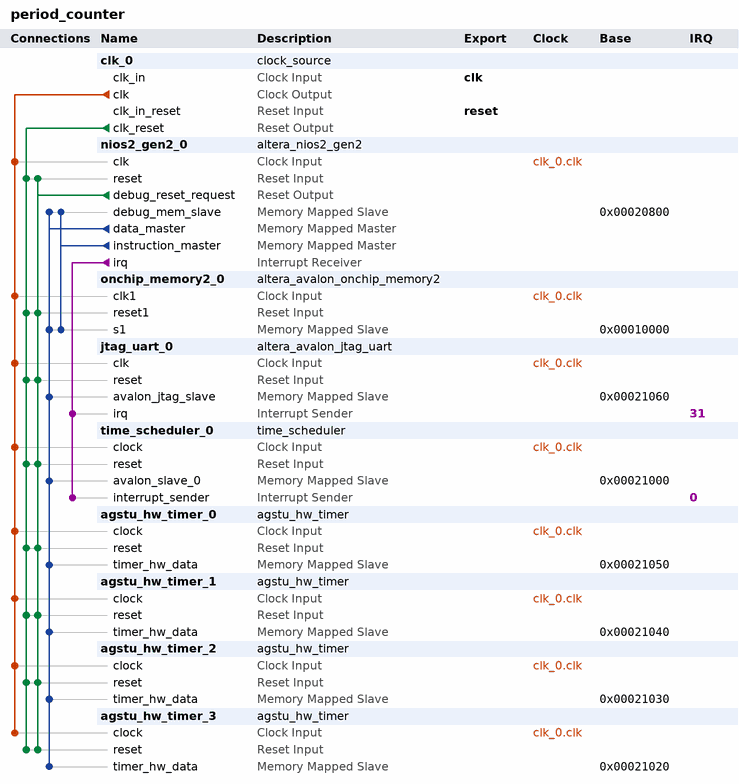
[diagram p0: system contents]
# Platform Designer (Qsys) system period_counter, MAX 10 10M50DAF484C7G
# Parameters at their usual value, and those the tool derives, are not listed.
package require -exact qsys 18.1
create_system period_counter
set_project_property DEVICE_FAMILY {MAX 10}
set_project_property DEVICE 10M50DAF484C7G

add_instance clk_0 clock_source 18.1
set_instance_parameter_value clk_0 clockFrequency 50000000

add_instance nios2_gen2_0 altera_nios2_gen2 18.1
set_instance_parameter_value nios2_gen2_0 dcache_size 2048
set_instance_parameter_value nios2_gen2_0 exceptionSlave onchip_memory2_0.s1
set_instance_parameter_value nios2_gen2_0 icache_size 4096
set_instance_parameter_value nios2_gen2_0 impl Tiny
set_instance_parameter_value nios2_gen2_0 resetSlave onchip_memory2_0.s1

add_instance onchip_memory2_0 altera_avalon_onchip_memory2 18.1
set_instance_parameter_value onchip_memory2_0 dataWidth 32
set_instance_parameter_value onchip_memory2_0 dualPort false
set_instance_parameter_value onchip_memory2_0 initMemContent false
set_instance_parameter_value onchip_memory2_0 initializationFileName onchip_mem.hex
set_instance_parameter_value onchip_memory2_0 memorySize 33796

add_instance jtag_uart_0 altera_avalon_jtag_uart 18.1
set_instance_parameter_value jtag_uart_0 simInteractiveOptions NO_INTERACTIVE_WINDOWS

add_instance time_scheduler_0 time_scheduler 1.0.1
set_instance_parameter_value time_scheduler_0 counter_height 3
set_instance_parameter_value time_scheduler_0 per0 2
set_instance_parameter_value time_scheduler_0 per1 7
set_instance_parameter_value time_scheduler_0 per10 11
set_instance_parameter_value time_scheduler_0 per11 12
set_instance_parameter_value time_scheduler_0 per12 13
set_instance_parameter_value time_scheduler_0 per13 14
set_instance_parameter_value time_scheduler_0 per14 15
set_instance_parameter_value time_scheduler_0 per15 16
set_instance_parameter_value time_scheduler_0 per2 15
set_instance_parameter_value time_scheduler_0 per3 4
set_instance_parameter_value time_scheduler_0 per4 5
set_instance_parameter_value time_scheduler_0 per5 6
set_instance_parameter_value time_scheduler_0 per6 7
set_instance_parameter_value time_scheduler_0 per7 8
set_instance_parameter_value time_scheduler_0 per8 9
set_instance_parameter_value time_scheduler_0 per9 10
set_instance_parameter_value time_scheduler_0 tick_length 25000000

add_instance agstu_hw_timer_0 agstu_hw_timer 0.0.2

add_instance agstu_hw_timer_1 agstu_hw_timer 0.0.2

add_instance agstu_hw_timer_2 agstu_hw_timer 0.0.2

add_instance agstu_hw_timer_3 agstu_hw_timer 0.0.2

# connections
add_connection clk_0.clk agstu_hw_timer_0.clock clock
add_connection clk_0.clk agstu_hw_timer_1.clock clock
add_connection clk_0.clk agstu_hw_timer_2.clock clock
add_connection clk_0.clk agstu_hw_timer_3.clock clock
add_connection clk_0.clk jtag_uart_0.clk clock
add_connection clk_0.clk nios2_gen2_0.clk clock
add_connection clk_0.clk onchip_memory2_0.clk1 clock
add_connection clk_0.clk time_scheduler_0.clock clock
add_connection clk_0.clk_reset agstu_hw_timer_0.reset reset
add_connection clk_0.clk_reset agstu_hw_timer_1.reset reset
add_connection clk_0.clk_reset agstu_hw_timer_2.reset reset
add_connection clk_0.clk_reset agstu_hw_timer_3.reset reset
add_connection clk_0.clk_reset jtag_uart_0.reset reset
add_connection clk_0.clk_reset nios2_gen2_0.reset reset
add_connection clk_0.clk_reset onchip_memory2_0.reset1 reset
add_connection clk_0.clk_reset time_scheduler_0.reset reset
add_connection nios2_gen2_0.debug_reset_request agstu_hw_timer_0.reset reset
add_connection nios2_gen2_0.debug_reset_request agstu_hw_timer_1.reset reset
add_connection nios2_gen2_0.debug_reset_request agstu_hw_timer_2.reset reset
add_connection nios2_gen2_0.debug_reset_request agstu_hw_timer_3.reset reset
add_connection nios2_gen2_0.debug_reset_request jtag_uart_0.reset reset
add_connection nios2_gen2_0.debug_reset_request nios2_gen2_0.reset reset
add_connection nios2_gen2_0.debug_reset_request onchip_memory2_0.reset1 reset
add_connection nios2_gen2_0.debug_reset_request time_scheduler_0.reset reset
add_connection nios2_gen2_0.data_master agstu_hw_timer_0.timer_hw_data avalon
set_connection_parameter_value nios2_gen2_0.data_master/agstu_hw_timer_0.timer_hw_data baseAddress 0x00021050
add_connection nios2_gen2_0.data_master agstu_hw_timer_1.timer_hw_data avalon
set_connection_parameter_value nios2_gen2_0.data_master/agstu_hw_timer_1.timer_hw_data baseAddress 0x00021040
add_connection nios2_gen2_0.data_master agstu_hw_timer_2.timer_hw_data avalon
set_connection_parameter_value nios2_gen2_0.data_master/agstu_hw_timer_2.timer_hw_data baseAddress 0x00021030
add_connection nios2_gen2_0.data_master agstu_hw_timer_3.timer_hw_data avalon
set_connection_parameter_value nios2_gen2_0.data_master/agstu_hw_timer_3.timer_hw_data baseAddress 0x00021020
add_connection nios2_gen2_0.data_master jtag_uart_0.avalon_jtag_slave avalon
set_connection_parameter_value nios2_gen2_0.data_master/jtag_uart_0.avalon_jtag_slave baseAddress 0x00021060
add_connection nios2_gen2_0.data_master nios2_gen2_0.debug_mem_slave avalon
set_connection_parameter_value nios2_gen2_0.data_master/nios2_gen2_0.debug_mem_slave baseAddress 0x00020800
add_connection nios2_gen2_0.data_master onchip_memory2_0.s1 avalon
set_connection_parameter_value nios2_gen2_0.data_master/onchip_memory2_0.s1 baseAddress 0x00010000
add_connection nios2_gen2_0.data_master time_scheduler_0.avalon_slave_0 avalon
set_connection_parameter_value nios2_gen2_0.data_master/time_scheduler_0.avalon_slave_0 baseAddress 0x00021000
add_connection nios2_gen2_0.instruction_master nios2_gen2_0.debug_mem_slave avalon
set_connection_parameter_value nios2_gen2_0.instruction_master/nios2_gen2_0.debug_mem_slave baseAddress 0x00020800
add_connection nios2_gen2_0.instruction_master onchip_memory2_0.s1 avalon
set_connection_parameter_value nios2_gen2_0.instruction_master/onchip_memory2_0.s1 baseAddress 0x00010000
add_connection nios2_gen2_0.irq jtag_uart_0.irq interrupt
set_connection_parameter_value nios2_gen2_0.irq/jtag_uart_0.irq irqNumber 31
add_connection nios2_gen2_0.irq time_scheduler_0.interrupt_sender interrupt
set_connection_parameter_value nios2_gen2_0.irq/time_scheduler_0.interrupt_sender irqNumber 0

# exported interfaces
add_interface clk clock sink
set_interface_property clk EXPORT_OF clk_0.clk_in
add_interface reset reset sink
set_interface_property reset EXPORT_OF clk_0.clk_in_reset

set_interconnect_requirement {$system} qsys_mm.clockCrossingAdapter HANDSHAKE
set_interconnect_requirement {$system} qsys_mm.enableEccProtection FALSE
set_interconnect_requirement {$system} qsys_mm.insertDefaultSlave FALSE
set_interconnect_requirement {$system} qsys_mm.maxAdditionalLatency 1

save_system period_counter.qsys
